# EAGLE design profi506_avr_kbd (EAGLE 8.5.2)
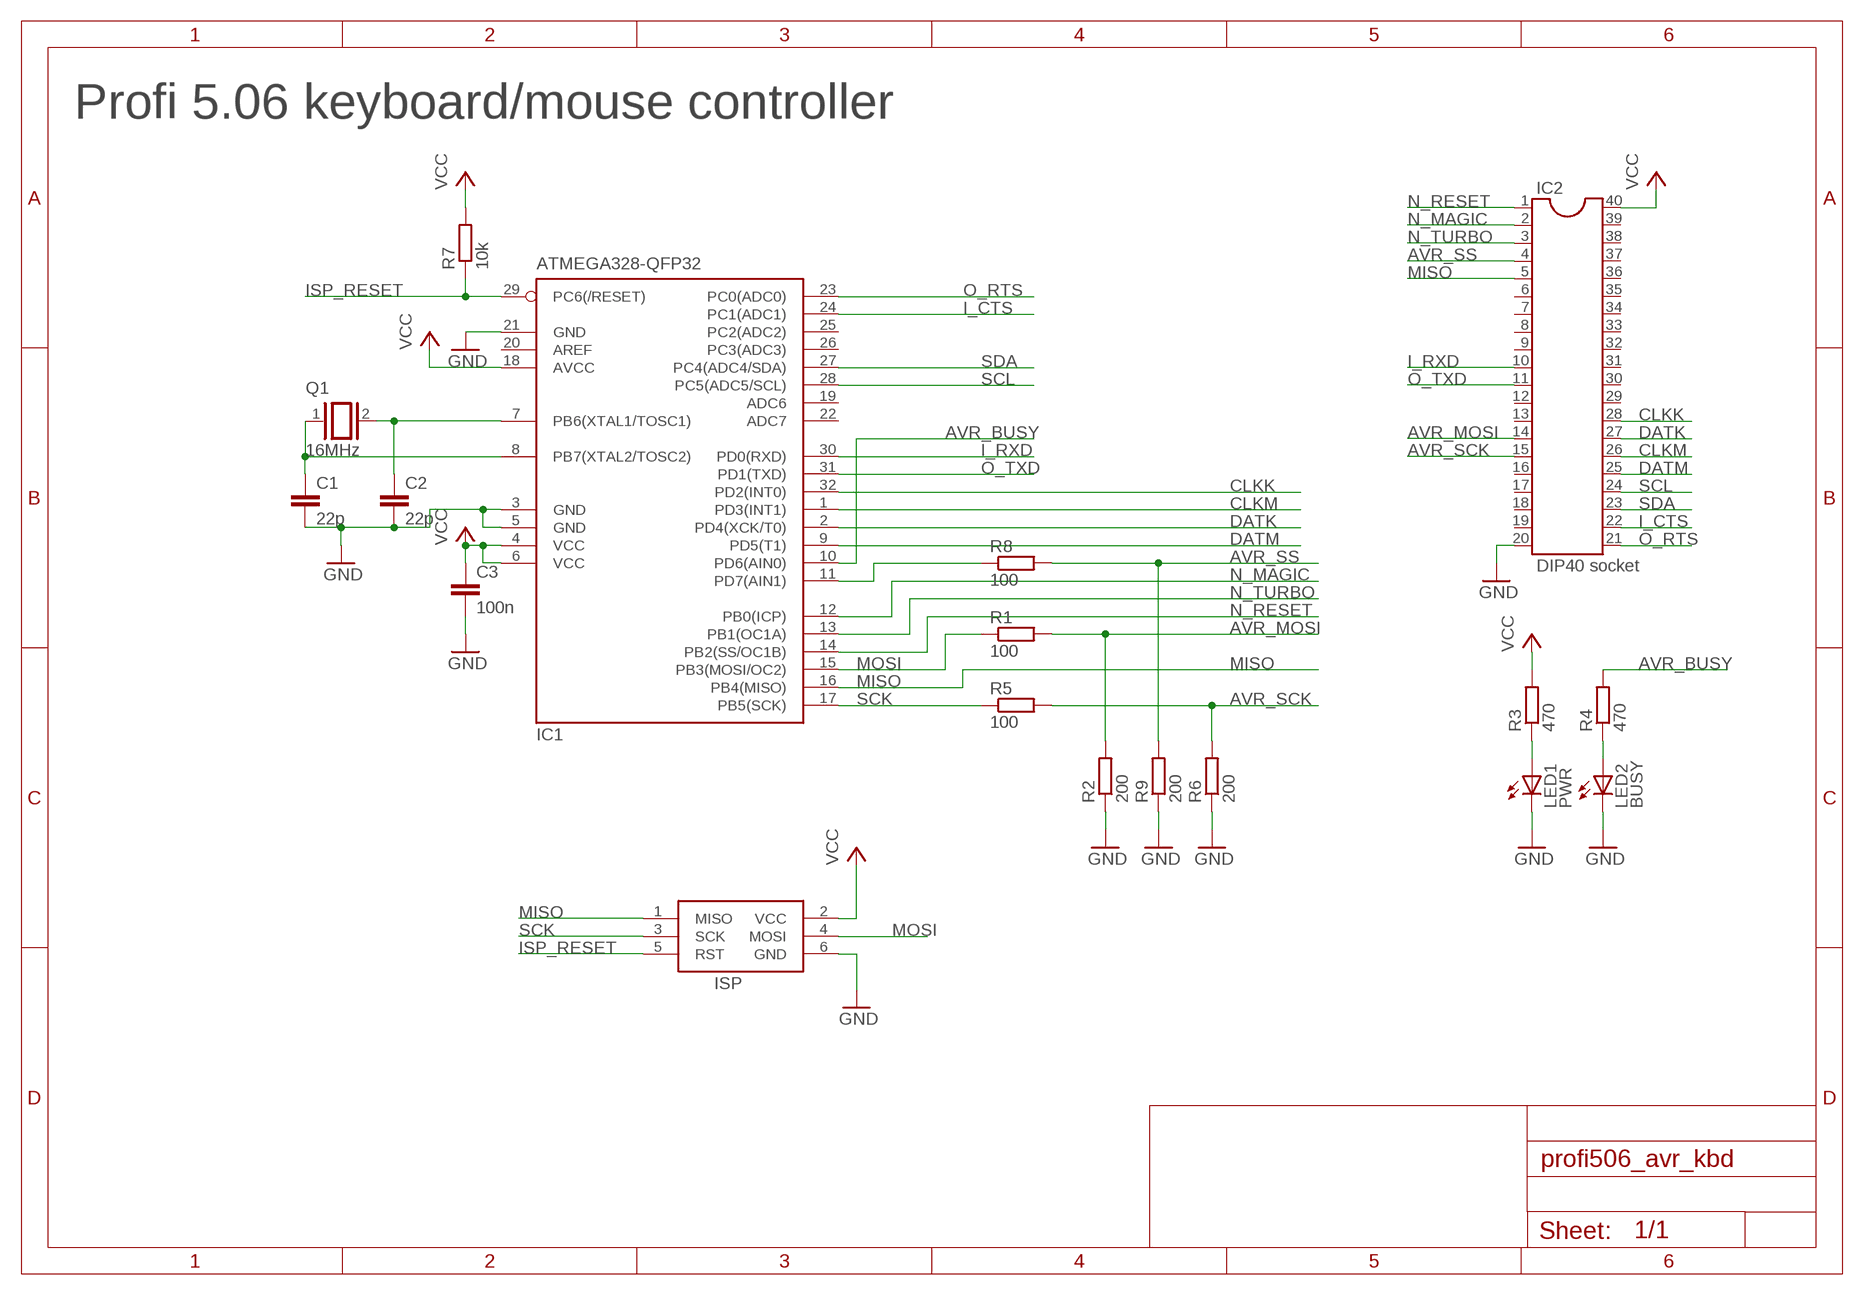
[diagram p0: schematic, sheet 1]

## Parts
C1  22p  C-EUC0805  [C0805]
C2  22p  C-EUC0805  [C0805]
C3  100n  C-EUC0805  [C0805]
IC1  ATMEGA328-QFP32  MEGA8-AI  [TQFP32-08]
IC2  DIP40 socket  DIL40  [DIL40]
ISP  AVRISP-BOX  [AVRISP-BOX]
LED1  PWR  LEDCHIPLED_0805  [CHIPLED_0805]
LED2  BUSY  LEDCHIPLED_0805  [CHIPLED_0805]
Q1  16MHz  XTAL/S  [QS]
R1  100  R-EU_R0805  [R0805]
R2  200  R-EU_R0805  [R0805]
R3  470  R-EU_R0805  [R0805]
R4  470  R-EU_R0805  [R0805]
R5  100  R-EU_R0805  [R0805]
R6  200  R-EU_R0805  [R0805]
R7  10k  R-EU_R0805  [R0805]
R8  100  R-EU_R0805  [R0805]
R9  200  R-EU_R0805  [R0805]

## Nets
AVR_BUSY: IC1.10(PD6(AIN0)) R4.2
AVR_MOSI: IC2.14 R1.2 R2.2
AVR_SCK: IC2.15 R5.2 R6.2
AVR_SS: IC2.4 R8.2 R9.2
CLKK: IC1.32(PD2(INT0)) IC2.28
CLKM: IC1.1(PD3(INT1)) IC2.26
DATK: IC1.2(PD4(XCK/T0)) IC2.27
DATM: IC1.9(PD5(T1)) IC2.25
GND: C1.2 C2.2 C3.2 IC1.3(GND) IC1.5(GND) IC1.21(GND) IC2.20 ISP.6(GND) LED1.C LED2.C R2.1 R6.1 R9.1
I_CTS: IC1.24(PC1(ADC1)) IC2.22
I_RXD: IC1.30(PD0(RXD)) IC2.10
ISP_RESET: IC1.29(PC6(/RESET)) ISP.5(RST) R7.1
MISO: IC1.16(PB4(MISO)) IC2.5 ISP.1(MISO)
MOSI: IC1.15(PB3(MOSI/OC2)) ISP.4(MOSI) R1.1
N$1: C2.1 IC1.7(PB6(XTAL1/TOSC1)) Q1.2
N$2: C1.1 IC1.8(PB7(XTAL2/TOSC2)) Q1.1
N$3: IC1.11(PD7(AIN1)) R8.1
N$4: LED1.A R3.1
N$5: LED2.A R4.1
N_MAGIC: IC1.12(PB0(ICP)) IC2.2
N_RESET: IC1.14(PB2(SS/OC1B)) IC2.1
N_TURBO: IC1.13(PB1(OC1A)) IC2.3
O_RTS: IC1.23(PC0(ADC0)) IC2.21
O_TXD: IC1.31(PD1(TXD)) IC2.11
SCK: IC1.17(PB5(SCK)) ISP.3(SCK) R5.1
SCL: IC1.28(PC5(ADC5/SCL)) IC2.24
SDA: IC1.27(PC4(ADC4/SDA)) IC2.23
VCC: C3.1 IC1.4(VCC) IC1.6(VCC) IC1.18(AVCC) IC2.40 ISP.2(VCC) R3.2 R7.2
Unconnected: IC1.19(ADC6) IC1.20(AREF) IC1.22(ADC7) IC1.25(PC2(ADC2)) IC1.26(PC3(ADC3)) IC2.6 IC2.7 IC2.8 IC2.9 IC2.12 IC2.13 IC2.16 IC2.17 IC2.18 IC2.19 IC2.29 IC2.30 IC2.31 IC2.32 IC2.33 IC2.34 IC2.35 IC2.36 IC2.37 IC2.38 IC2.39

## Notes on the sheet
- Profi 5.06 keyboard/mouse controller

## Library data of the parts
C1-C3 = resistor:C-EU: CAPACITOR, European symbol
IC1 = atmel:MEGA8: MICROCONTROLLER 8 Kbytes FLASH, 1 kbytes SRAM, 512 bytes EEPROM, USART, 6-channel 10 bit ADC, 2-channel 8 bit ADC Pin compatible with Atmega48, ATMega88, ATMega168 Source: avr.lbr; MPN: ATMEGA8-16AU; OC_FARNELL: 9171371; OC_NEWARK: 73M8863
IC2 = ic-package:DIL40: Dual In Line
ISP = adafruit:AVRISP: AVR ISP HEADER Standard 6 pin header for AVR programming
LED1 LED2 = adafruit:LED: LED OSRAM: - CHIPLED LG R971, LG N971, LY N971, LG Q971, LY Q971, LO R971, LY R971 LH N974, LH R974 LS Q976, LO Q976, LY Q976 LO Q996 - Hyper CHIPLED LW Q18S LB Q993, LB Q99A, LB R99A - SideLED LS A670, LO A670, LY A670, LG A670, LP A670 LB A673, LV A673, LT A673, LW A673 LH A674 LY A675 LS A676, LA A676, LO A676, LY A676, LW A676 LS A679, LY A679, LG A679 - Hyper Micro SIDELED® LS Y876, LA Y876, LO Y876, LY Y876 LT Y87S - SmartLED LW L88C, LW L88S LB L89C, LB L89S, LG L890 LS L89K, LO L89K, LY L89K LS L896, LA L896, LO L896, LY L896 - TOPLED LS T670, LO T670, LY T670, LG T670, LP T670 LSG T670, LSP T670, LSY T670, LOP T670, LYG T670 LG T671, LOG T671, LSG T671 LB T673, LV T673, LT T673, LW T673 LH T674 LS T676, LA T676, LO T676, LY T676, LB T676, LH T676, LSB T676, LW T676 LB T67C, LV T67C, LT T67C, LS T67K, LO T67K, LY T67K, LW E67C LS E67B, LA E67B, LO E67B, LY E67B, LB E67C, LV E67C, LT E67C LW T67C LS T679, LY T679, LG T679 LS T770, LO T770, LY T770, LG T770, LP T770 LB T773, LV T773, LT T773, LW T773 LH T774 LS E675, LA E675, LY E675, LS T675 LS T776, LA T776, LO T776, LY T776, LB T776 LHGB T686 LT T68C, LB T68C - Hyper Mini TOPLED® LB M676 - Mini TOPLED Santana® LG M470 LS M47K, LO M47K, LY M47K Source: http://www.osram.convergy.de/
Q1 = special:XTAL/S: CRYSTAL
R1-R9 = rcl:R-EU_: RESISTOR, European symbol

## Board
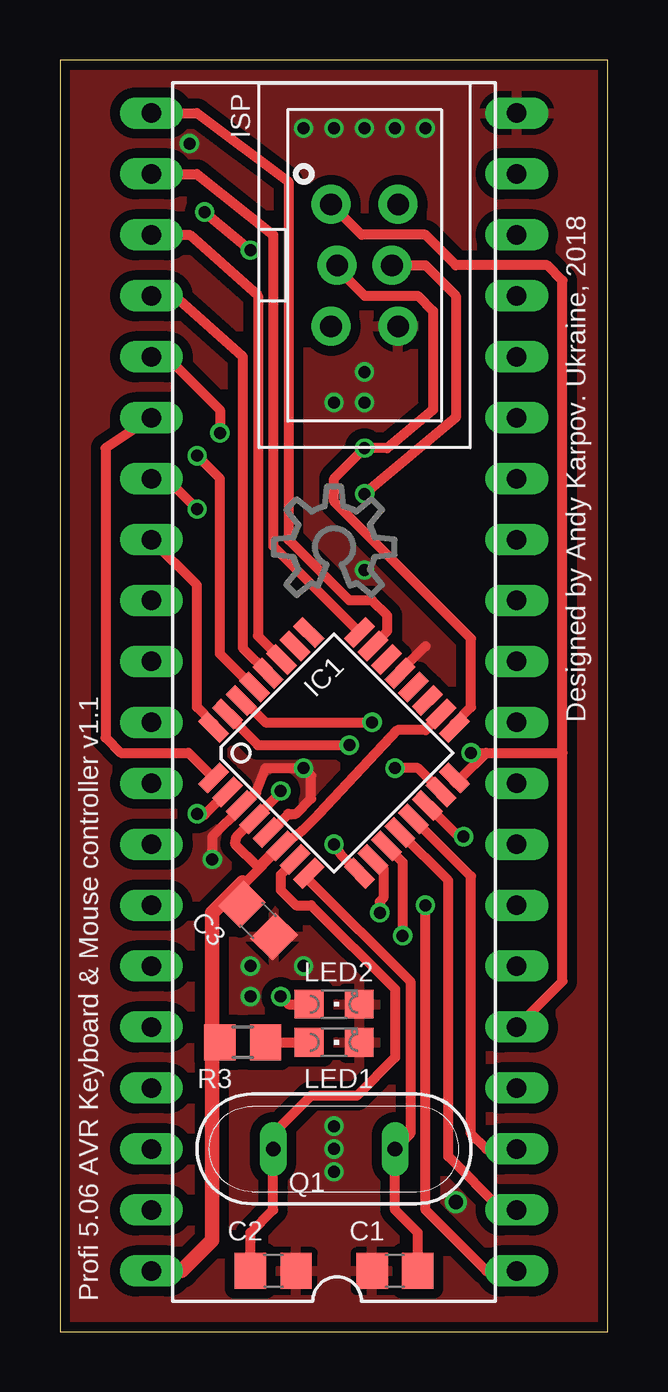
[diagram p1: board, top side]
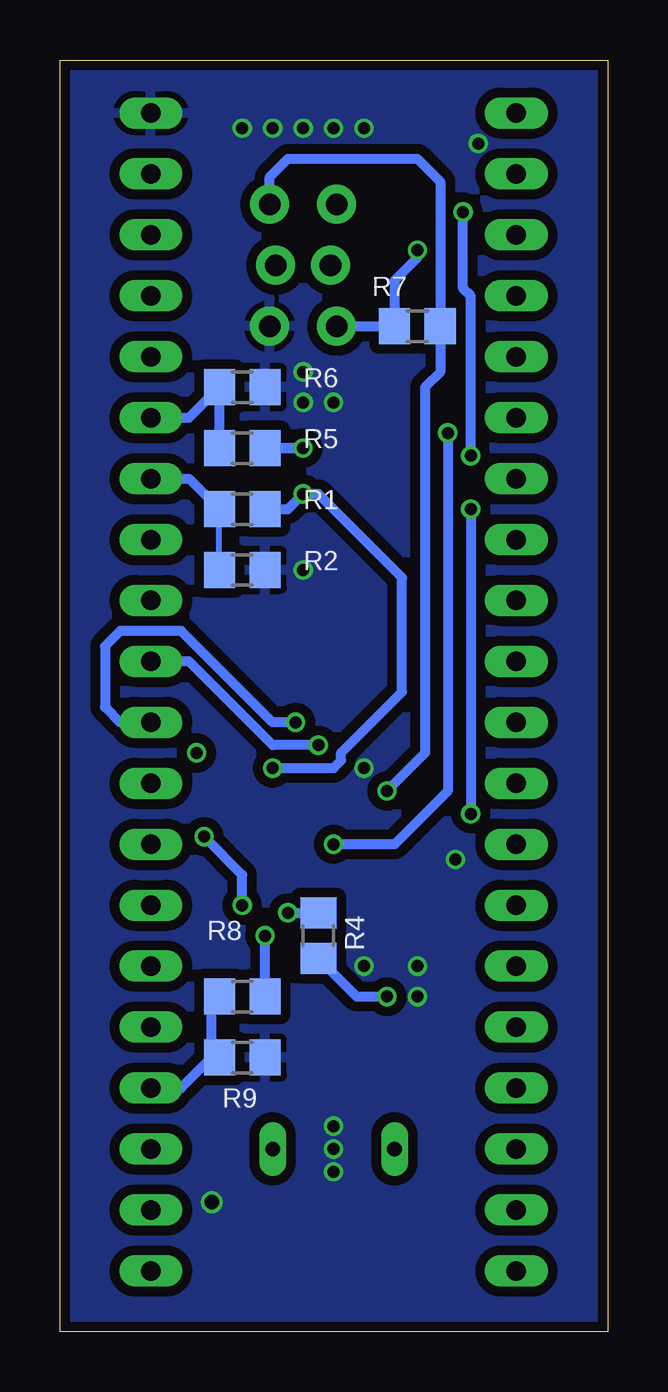
[diagram p2: board, bottom side, seen from below]

Size 22.84 x 53.01 mm. Coordinates in mm from the lower left corner, seen from the top.
Outline: 0,0 22.84,0 22.84,53.01 0,53.01 0,0
Copper layers (1*16): Top 0.035mm / dielectric 1.5mm / Bottom 0.035mm
Design rules "SeeedStudio_2layer_DRU_no_angle_20140221": minimum track width 6mil, minimum drill 12mil, track to track 6mil, track to pad 6mil, pad to pad 6mil, via to via 6mil, smd to smd 0mil, copper to edge 10mil, drill to drill 10mil, minimum pad ring 10mil, minimum via ring 6mil, stop-mask expansion 2mil, vias tented up to drill 100mil, thermal gap 10mil

### Footprints (pad centres in the part's own frame; a part is rotated, then mirrored left to right if it is on the bottom)
C0805 = smd 1.3 x 1.5: 1 -0.95,0; 2 0.95,0
TQFP32-08 = smd 1.27 x 0.559: 1 -4.293,2.8; 2 -4.293,2; 3 -4.293,1.2; 4 -4.293,0.4; 5 -4.293,-0.4; 6 -4.293,-1.2; 7 -4.293,-2; 8 -4.293,-2.8; 17 4.293,-2.8; 18 4.293,-2; 19 4.293,-1.2; 20 4.293,-0.4; 21 4.293,0.4; 22 4.293,1.2; 23 4.293,2; 24 4.293,2.8 | smd 0.559 x 1.27: 9 -2.8,-4.293; 10 -2,-4.293; 11 -1.2,-4.293; 12 -0.4,-4.293; 13 0.4,-4.293; 14 1.2,-4.293; 15 2,-4.293; 16 2.8,-4.293; 25 2.8,4.293; 26 2,4.293; 27 1.2,4.293; 28 0.4,4.293; 29 -0.4,4.293; 30 -1.2,4.293; 31 -2,4.293; 32 -2.8,4.293
DIL40 = drill 0.813 long: 1 -24.13,-7.62; 2 -21.59,-7.62; 3 -19.05,-7.62; 4 -16.51,-7.62; 5 -13.97,-7.62; 6 -11.43,-7.62; 7 -8.89,-7.62; 8 -6.35,-7.62; 9 -3.81,-7.62; 10 -1.27,-7.62; 11 1.27,-7.62; 12 3.81,-7.62; 13 6.35,-7.62; 14 8.89,-7.62; 15 11.43,-7.62; 16 13.97,-7.62; 17 16.51,-7.62; 18 19.05,-7.62; 19 21.59,-7.62; 20 24.13,-7.62; 21 24.13,7.62; 22 21.59,7.62; 23 19.05,7.62; 24 16.51,7.62; 25 13.97,7.62; 26 11.43,7.62; 27 8.89,7.62; 28 6.35,7.62; 29 3.81,7.62; 30 1.27,7.62; 31 -1.27,7.62; 32 -3.81,7.62; 33 -6.35,7.62; 34 -8.89,7.62; 35 -11.43,7.62; 36 -13.97,7.62; 37 -16.51,7.62; 38 -19.05,7.62; 39 -21.59,7.62; 40 -24.13,7.62
AVRISP-BOX = drill 0.9 pad 1.626: 1 -1.397,2.54; 2 1.397,2.54; 3 -1.143,0; 4 1.143,0; 5 -1.397,-2.54; 6 1.397,-2.54
CHIPLED_0805 = smd 1.2 x 1.2: A 0,-1.05; C 0,1.05
QS = drill 0.61 long: 1 -2.54,0; 2 2.54,0
R0805 = smd 1.3 x 1.5: 1 -0.95,0; 2 0.95,0

### Placement (x,y rotation side)
C1  13.97,2.54 180 top
C2  8.89,2.54 0 top
C3  8.26,17.14 315 top
IC1  11.43,24.13 45 top
IC2  11.43,26.67 90 top
ISP  12.7,44.45 0 top
LED1  11.43,12.06 270 top
LED2  11.43,13.65 270 top
Q1  11.43,7.62 180 top
R1  15.24,34.29 180 bottom
R2  15.24,31.75 180 bottom
R3  7.62,12.06 180 top
R4  12.06,16.51 90 bottom
R5  15.24,36.83 180 bottom
R6  15.24,39.37 180 bottom
R7  7.94,41.91 0 bottom
R8  15.24,13.97 180 bottom
R9  15.24,11.43 180 bottom
U$1  [OSHWLOGO_TOL_0.2]  11.43,32.7 0 top

### Tracks (layer width: path | path; a pad name or v marks a point on that pad's centre or on a via)
AVR_BUSY  (via drill 0.5)
  Top 0.406: IC1.10 13.05,19.77 13.49,19.33 13.49,18.08 13.34,17.93 v13.34,17.46
  Bottom 0.406: v13.34,17.46 R4.2
AVR_MOSI
  Bottom 0.254: R2.2 16.23,31.77 16.23,34.29 R1.2
  Bottom 0.406: IC2.14 17.46,35.56 R1.2
AVR_SCK
  Bottom 0.406: IC2.15 17.46,38.1 R6.2 R5.2
AVR_SS
  Bottom 0.406: 16.51,11.43 17.78,10.16 IC2.4 | 16.51,11.43 16.51,13.97 R8.2 | 16.51,11.43 R9.2
CLKK
  Top 0.406: IC1.32 6.42,25.34 5.71,26.04 5.71,31.11 IC2.28
CLKM
  Top 0.406: IC2.26 1.91,36.83 1.91,24.77 2.54,24.13 5.36,24.13 IC1.1
DATK  (via drill 0.5)
  Top 0.406: IC2.27 4.45,35.56 v5.71,34.29 | v5.71,21.59 6.03,21.56 IC1.2
  Bottom 0.406: v5.71,34.29 v5.71,21.59
DATM  (via drill 0.5)
  Top 0.406: IC2.25 4.45,40.64 6.67,38.42 v6.67,37.47 | v11.43,20.32 11.75,19.85 IC1.9
  Bottom 0.406: v6.67,37.47 6.67,22.54 8.89,20.32 v11.43,20.32
GND  (via drill 0.5, 0.6)
  Top 0.406: IC1.5 8.75,20.81 9.53,21.59 9.84,21.59 10.48,22.23 10.48,23.18 v10.16,23.5 8.57,23.5 8.18,22.47 IC1.3 7.55,21.83 6.35,20.64 v6.35,19.68 | 14.11,27.45 IC1.21 14.18,27.52 15.24,28.57
  other vias: 11.43,8.57 11.43,6.67 12.7,40.01 12.7,50.16 12.7,38.73 10.16,15.24 12.7,31.75 16.51,5.4 7.94,13.97 11.43,38.73 13.97,50.16 11.43,50.16 10.16,50.16 15.24,50.16 5.4,49.53 7.94,15.24 11.43,7.62
  pour Top (isolate 0.406): 0,53.34 22.86,53.34 22.86,0 0,0
  pour Bottom (isolate 0.406): 0,53.34 22.86,53.34 22.86,0 0,0
I_CTS
  Top 0.406: IC2.22 5.71,48.26 8.89,45.72 8.89,32.74 IC1.24
I_RXD  (via drill 0.5)
  Top 0.406: IC1.30 7.86,26.11 8.57,25.4 v13.02,25.4
  Bottom 0.406: v13.02,25.4 13.97,25.4 17.78,29.21 20.32,29.21 20.95,28.57 20.95,26.04 20.32,25.4 IC2.10
ISP_RESET  (via drill 0.5)
  Top 0.406: IC1.29 8.04,26.88 6.67,28.26 6.67,35.56 v5.71,36.51 | v6.03,46.67 v7.94,45.09
  Bottom 0.406: ISP.5 R7.1 8.89,43.81 7.94,44.77 v7.94,45.09 | v5.71,36.51 5.71,43.18 6.03,43.5 v6.03,46.67
MISO  (via drill 0.5)
  Top 0.406: 11.3,46.86 ISP.1 12.57,45.72 15.24,45.72 16.51,44.45 20.32,44.45 20.95,43.81 20.95,24.13 | 17.78,24.13 16.73,23.07 IC1.16 16.45,22.93 16.51,22.86 16.83,22.86 | 17.78,24.13 20.95,24.13 | v17.14,24.13 17.78,24.13 | IC2.5 20.95,14.61 20.95,24.13
MOSI  (via drill 0.5)
  Top 0.406: ISP.4 15.24,44.45 16.51,43.18 16.51,38.1 v12.7,34.92 | IC1.15 15.88,22.54 14.92,23.5 v13.97,23.5
  Bottom 0.406: v13.97,23.5 11.43,23.5 11.11,23.81 11.11,24.13 8.57,26.67 8.57,31.43 12.06,34.92 v12.7,34.92 13.34,34.29 R1.1
N$1
  Top 0.406: C2.1 7.94,4.13 8.89,5.08 Q1.2 | Q1.2 8.89,7.94 | IC1.7 9.81,19.65 9.21,19.05 9.21,18.41 9.84,17.78 10.48,17.78 13.97,14.29 13.97,11.43 12.38,9.84 10.48,9.84 8.89,8.26 Q1.2
N$2
  Top 0.406: C1.1 14.92,4.13 13.97,5.08 Q1.1 14.61,8.26 14.61,14.61 10.38,18.84 IC1.8
N$3  (via drill 0.5)
  Top 0.406: IC1.11 14.29,19.57 14.29,19.05 v14.29,16.51
  Bottom 0.406: R8.1 v14.29,16.51
N$4
  Top 0.406: R3.1 LED1.A
N$5  (via drill 0.5)
  Top 0.406: v9.21,13.97 9.53,13.65 LED2.A
  Bottom 0.406: R4.1 10.47,13.97 v9.21,13.97
N_MAGIC
  Top 0.406: IC2.2 18.41,5.08 16.19,7.3 16.19,18.8 IC1.12
N_RESET  (via drill 0.5)
  Top 0.406: IC2.1 17.78,2.54 15.24,5.08 v15.24,17.78 | v16.83,20.64 16.62,20.64 IC1.14
  Bottom 0.406: v15.24,17.78 15.24,19.05 v16.83,20.64
N_TURBO
  Top 0.406: IC2.3 17.78,7.62 17.14,8.26 17.14,18.98 IC1.13
O_RTS
  Top 0.406: IC2.21 5.71,50.8 9.53,47.94 9.53,33.02 12.06,30.48 13.02,30.48 13.65,29.84 13.65,29.21 13.05,28.61 IC1.23
O_TXD  (via drill 0.5)
  Top 0.406: IC1.31 6.98,25.72 8.26,24.45 v12.06,24.45
  Bottom 0.406: v12.06,24.45 13.97,24.45 17.46,27.94 IC2.11
SCK  (via drill 0.5)
  Top 0.406: ISP.3 11.56,44.32 12.7,43.18 14.92,43.18 15.56,42.55 15.56,38.42 13.65,36.83 v12.7,36.83 11.43,35.56 11.43,34.61 17.14,28.89 17.14,26.04 16.45,25.34 IC1.17
  Bottom 0.406: 13.97,36.83 v12.7,36.83 R5.1
SCL
  Top 0.406: IC2.24 4.76,43.18 7.62,40.64 7.62,28.51 IC1.28
SDA
  Top 0.406: IC2.23 5.4,45.72 8.26,43.18 8.26,29 IC1.27
VCC  (via drill 0.5)
  Top 0.406: 7.62,18.73 7.73,18.73 IC1.6 | IC1.6 9.13,20.25 8.26,19.37 7.3,20.32 7.37,20.64 IC1.4 9.21,22.47 v9.21,22.54 | IC1.18 15.88,25.72 15.24,25.08 14.08,25.08 10.79,21.59 10.09,20.88 IC1.6 | C3.1 | C3.1 7.14,18.26 | R3.2 6.35,12.7
  Top 0.61: IC2.40 5.08,2.54 6.35,3.81 6.35,12.7 6.35,17.46 7.14,18.26 7.62,18.73
  Bottom 0.406: ISP.2 14.1,48.13 13.34,48.9 7.94,48.9 6.99,47.94 R7.2 | R7.2 | R7.2 6.99,40.01 7.62,39.37 7.62,24.13 v9.21,22.54

### Text on the board
tNames: Designed by Andy Karpov. Ukraine, 2018 | Profi 5.06 AVR Keyboard & Mouse controller v1.1